# EAGLE board Stepoko (EAGLE 6.5.0)
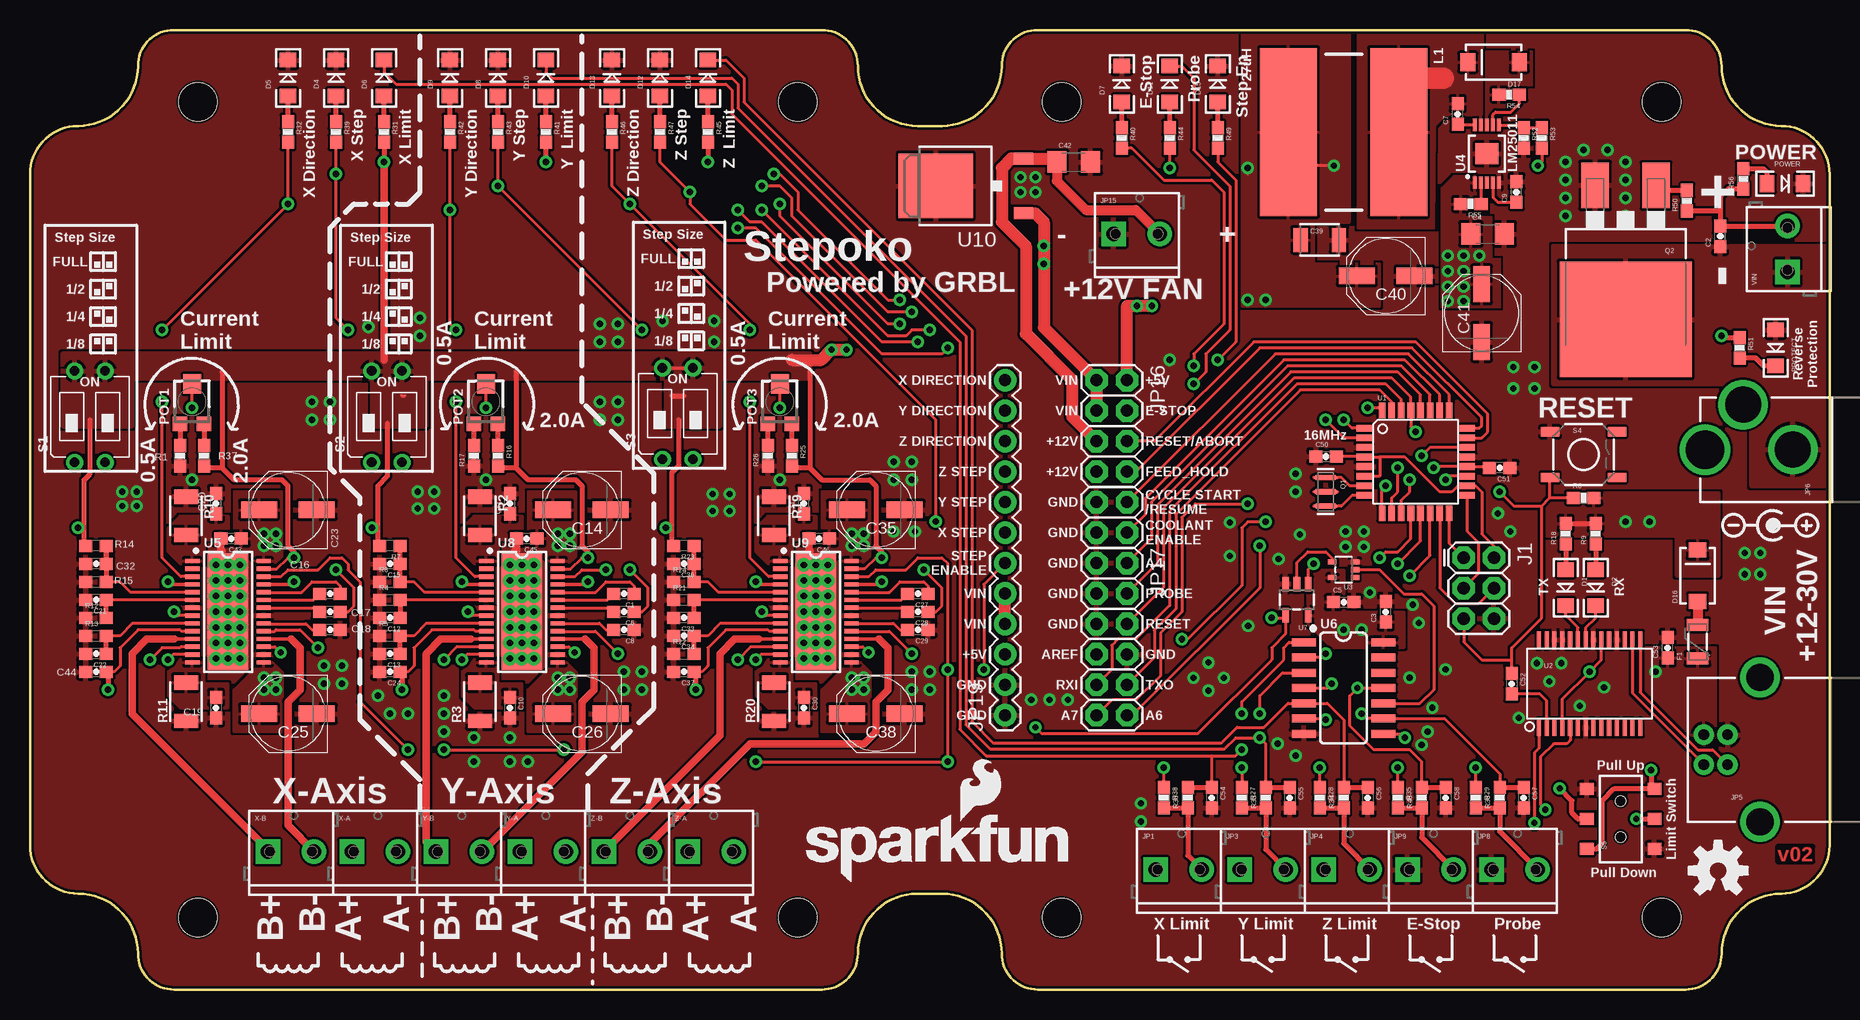
[diagram p2: board, top side]
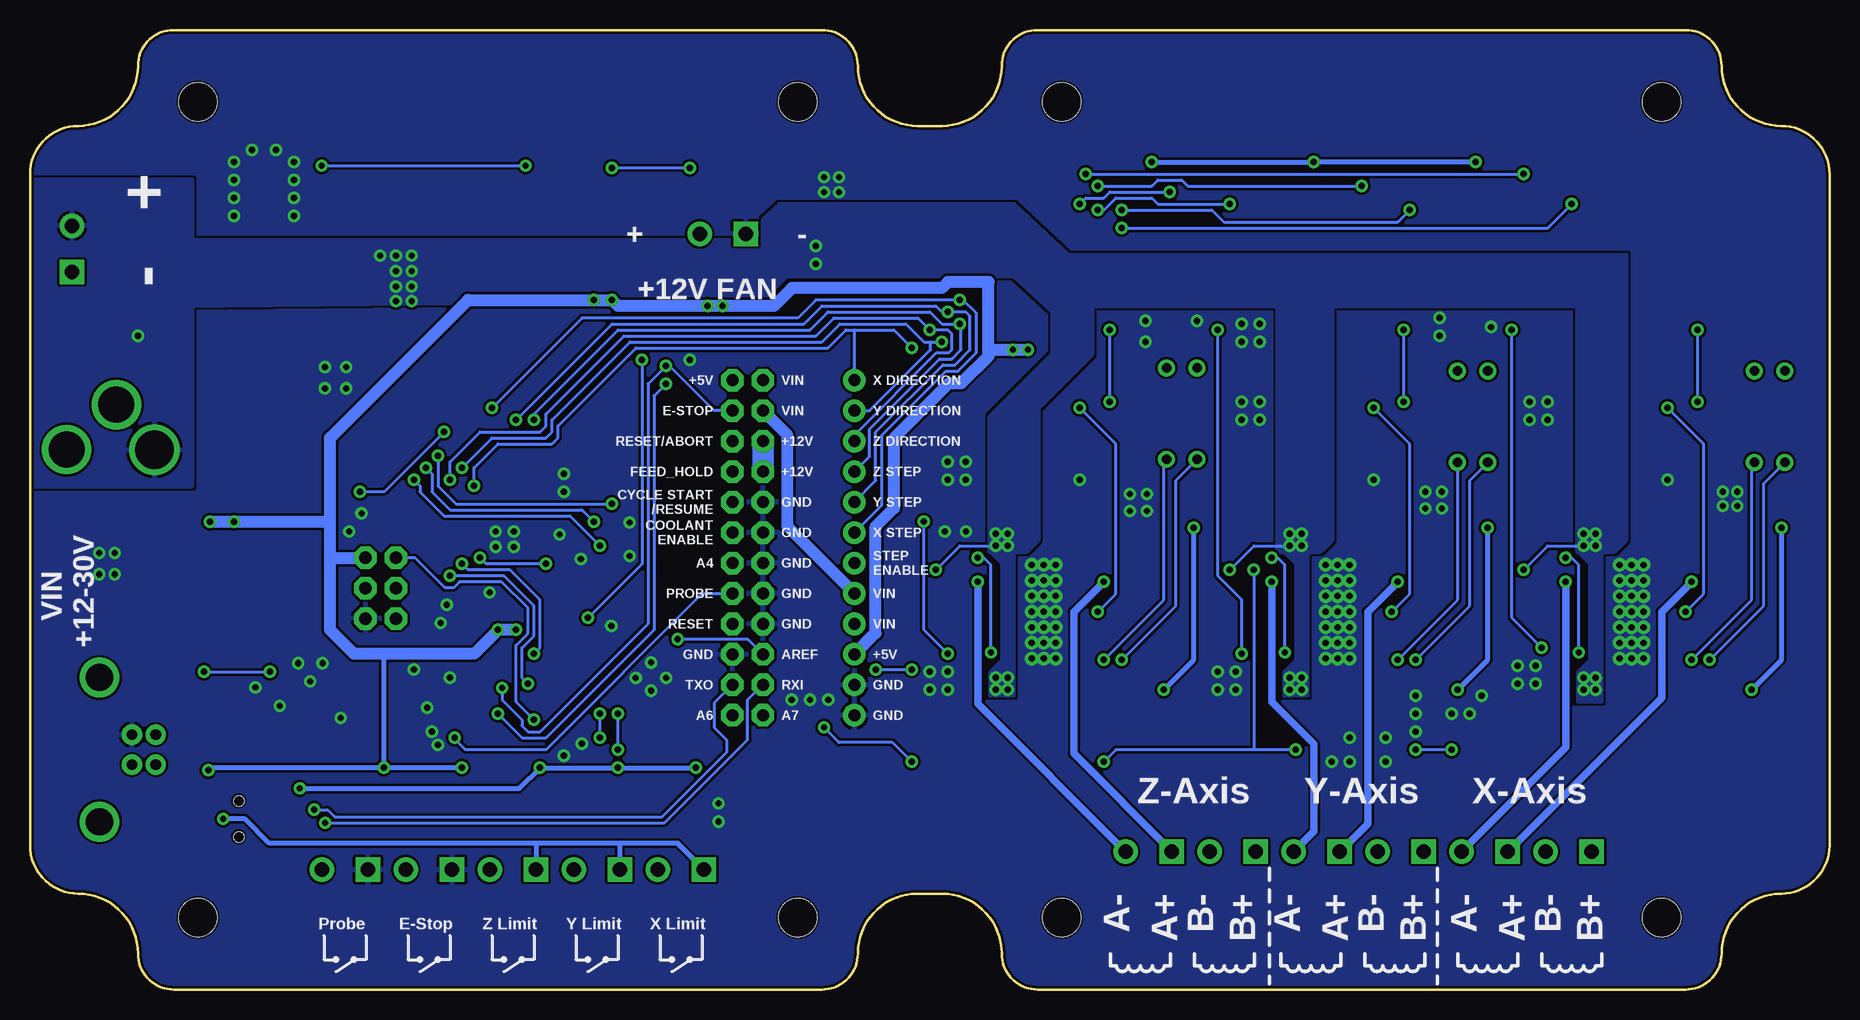
[diagram p3: board, bottom side, seen from below]

Size 150 x 80 mm. Coordinates in mm from the lower left corner, seen from the top.
Copper layers (1*16): Top 0.035mm / dielectric 1.5mm / Bottom 0.035mm
Design rules "SparkFun-2-layer": minimum track width 7mil, minimum drill 15mil, track to track 8mil, track to pad 8mil, pad to pad 8mil, via to via 8mil, smd to smd 8mil, copper to edge 8mil, drill to drill 8mil, minimum pad ring 12mil, minimum via ring 10mil, stop-mask expansion 4mil, vias tented up to drill 20mil, thermal gap 10mil

## Footprints (pad centres in the part's own frame; a part is rotated, then mirrored left to right if it is on the bottom)
0603-CAP = smd 1.1 x 1: 1 -0.85,0; 2 0.85,0
1206 = smd 1.6 x 1.8: 1 -1.4,0; 2 1.4,0
PANASONIC_D = smd 3 x 1.4: + 2.4,0; - -2.4,0
1210 = smd 1.2 x 2: 1 -1.6,0; 2 1.6,0
LED-1206 = smd 1.2 x 1.4: A -1.5,0; C 1.5,0
SMA-DIODE = smd 1.27 x 1.47: A -2.15,0; C 2.15,0
PTC-1206 = smd 1 x 1.8: 1 -1.4,0; 2 1.4,0
2X3 = drill 1.016 pad 1.88 octagon: 1 0,0; 2 0,2.54; 3 2.54,0; 4 2.54,2.54; 5 5.08,0; 6 5.08,2.54
SCREWTERMINAL-3.5MM-2_LOCK = drill 1.2 pad 2.032 square: 1 -0.178,0 | drill 1.2 pad 2.032: 2 3.678,0
USB-B-PTH = drill 0.914 pad 1.676: D+ 0,1.25; D- 1.981,1.25; GND 0,-1.25; VBUS 1.981,-1.25 | drill 2.286: S1 -2.718,-6.02; S2 -2.718,6.02
POWER_JACK_PTH_LOCK = drill 2.997 pad 4.115: GND 0.025,6.557; GNDBREAK 3.762,10.7 | drill 3.2 pad 4.115: PWR 0,13.878
2X6 = drill 1.016 pad 1.88 octagon: 1 0,0; 2 0,2.54; 3 2.54,0; 4 2.54,2.54; 5 5.08,0; 6 5.08,2.54; 7 7.62,0; 8 7.62,2.54; 9 10.16,0; 10 10.16,2.54; 11 12.7,0; 12 12.7,2.54
1X12 = drill 1.016 pad 1.88: 1 0,0; 2 2.54,0; 3 5.08,0; 4 7.62,0; 5 10.16,0; 6 12.7,0; 7 15.24,0; 8 17.78,0; 9 20.32,0; 10 22.86,0; 11 25.4,0; 12 27.94,0
INDUCTOR_SDR1307 = smd 14 x 4.75: P$1 0,4.6; P$2 0,-4.6
TC33X = smd 1.2 x 1.2: 1 -1,-1.825; 3 1,-1.825 | smd 1.5 x 1.6: 2 0,1.5
RESONATOR-SMD = smd 0.45 x 1.905: 1 -1.2,0; 2 0,0; 3 1.2,0
TO-263/D2PAK = smd 2.32 x 3.81: 1 -2.54,-7.045; 3 2.54,-7.045 | smd 11 x 9.65: 2 0,4.125
0603-RES = smd 1.1 x 1: 1 -0.85,0; 2 0.85,0
0603 = smd 1.1 x 1: 1 -0.85,0; 2 0.85,0
209-2LPST = drill 0.8: 1 -1.27,-3.81; 2 1.27,-3.81; 3 1.27,3.81; 4 -1.27,3.81
TACTILE-SWITCH-SMD = smd 1.524 x 0.762: 1 -2.794,1.905; 2 2.794,1.905; 3 -2.794,-1.905; 4 2.794,-1.905
AYZ0202 = smd 1 x 1.15: 1 -2.5,2.825; 2 0,2.825; 3 2.5,2.825; 4 -2.5,-2.825; 5 0,-2.825; 6 2.5,-2.825 | hole 0.85: 1.5,0; -1.5,0
TQFP32-08 = smd 1.27 x 0.559: 1 -4.293,2.8; 2 -4.293,2; 3 -4.293,1.2; 4 -4.293,0.4; 5 -4.293,-0.4; 6 -4.293,-1.2; 7 -4.293,-2; 8 -4.293,-2.8; 17 4.293,-2.8; 18 4.293,-2; 19 4.293,-1.2; 20 4.293,-0.4; 21 4.293,0.4; 22 4.293,1.2; 23 4.293,2; 24 4.293,2.8 | smd 0.559 x 1.27: 9 -2.8,-4.293; 10 -2,-4.293; 11 -1.2,-4.293; 12 -0.4,-4.293; 13 0.4,-4.293; 14 1.2,-4.293; 15 2,-4.293; 16 2.8,-4.293; 25 2.8,4.293; 26 2,4.293; 27 1.2,4.293; 28 0.4,4.293; 29 -0.4,4.293; 30 -1.2,4.293; 31 -2,4.293; 32 -2.8,4.293
SSOP28DB = smd 0.348 x 1.397: 1 -4.225,-3.656; 2 -3.575,-3.656; 3 -2.925,-3.656; 4 -2.275,-3.656; 5 -1.625,-3.656; 6 -0.975,-3.656; 7 -0.325,-3.656; 8 0.325,-3.656; 9 0.975,-3.656; 10 1.625,-3.656; 11 2.275,-3.656; 12 2.925,-3.656; 13 3.575,-3.656; 14 4.225,-3.656; 15 4.225,3.656; 16 3.575,3.656; 17 2.925,3.656; 18 2.275,3.656; 19 1.625,3.656; 20 0.975,3.656; 21 0.325,3.656; 22 -0.325,3.656; 23 -0.975,3.656; 24 -1.625,3.656; 25 -2.275,3.656; 26 -2.925,3.656; 27 -3.575,3.656; 28 -4.225,3.656
SOT353 = smd 0.42 x 0.7: 1 -0.65,-0.95; 2 0,-0.95; 3 0.65,-0.95; 4 0.65,0.95; 5 -0.65,0.95
HVSS0P-10 = smd 0.3 x 1.02: 1 -1,-2.4; 2 -0.5,-2.4; 3 0,-2.4; 4 0.5,-2.4; 5 1,-2.4; 6 1,2.4; 7 0.5,2.4; 8 0,2.4; 9 -0.5,2.4; 10 -1,2.4 | smd 1.905 x 1.727: PAD 0,0
HTSSOP28 = smd 0.36 x 1.19: 1 -4.225,-2.97; 2 -3.575,-2.97; 3 -2.925,-2.97; 4 -2.275,-2.97; 5 -1.625,-2.97; 6 -0.975,-2.97; 7 -0.325,-2.97; 8 0.325,-2.97; 9 0.975,-2.97; 10 1.625,-2.97; 11 2.275,-2.97; 12 2.925,-2.97; 13 3.575,-2.97; 14 4.225,-2.97; 15 4.225,2.97; 16 3.575,2.97; 17 2.925,2.97; 18 2.275,2.97; 19 1.625,2.97; 20 0.975,2.97; 21 0.325,2.97; 22 -0.325,2.97; 23 -0.975,2.97; 24 -1.625,2.97; 25 -2.275,2.97; 26 -2.925,2.97; 27 -3.575,2.97; 28 -4.225,2.97 | drill 0.508: GND@10 -3.9,1; GND@11 -3.9,0; GND@12 -3.9,-1; GND@13 -2.6,-1; GND@14 -2.6,0; GND@15 -2.6,1; GND@16 -1.3,1; GND@17 -1.3,0; GND@18 -1.3,-1; GND@19 0,-1; GND@20 0,0; GND@21 0,1; GND@22 1.3,1; GND@23 1.3,0; GND@24 1.3,-1; GND@25 2.6,-1; GND@26 2.6,0; GND@27 2.6,1; GND@28 3.9,1; GND@29 3.9,0; GND@30 3.9,-1 | smd 9.7 x 3.4: GND@PAD 0,0
SOIC-14 = smd 0.66 x 2.032: 1 -4.445,-3.315; 2 -3.175,-3.315; 3 -1.905,-3.315; 4 -0.635,-3.315; 5 0.635,-3.315; 6 1.905,-3.315; 7 3.175,-3.315; 8 3.175,3.315; 9 1.905,3.315; 10 0.635,3.315; 11 -0.635,3.315; 12 -1.905,3.315; 13 -3.175,3.315; 14 -4.445,3.315
SOT23-5 = smd 0.55 x 1.2: 1 -0.95,-1.3; 2 0,-1.3; 3 0.95,-1.3; 4 0.95,1.3; 5 -0.95,1.3
TO-252 = smd 1 x 1.6: 1 -2.28,-4.8; 2 2.28,-4.8 | smd 5.4 x 6.2: 3 0,2.5
FLANGED_RED_ENCLOSURE-DIMENSION-NO-INNER-HOLES = hole 3.175: 64,6; 86,6; 136,6; 14,6; 64,74; 86,74; 136,74; 14,74

## Placement (x,y rotation side)
C1  0.22uF  [0603-CAP]  49.5,33 180 top
C2  0.1uF  [0603-CAP]  140.89,62.8 90 top
C3  0.1uF  [0603-CAP]  113,31.5 90 top
C4  1.0uF  [1206]  121.5,63 0 top
C5  0.1uF  [0603-CAP]  109.5,32.3 0 top
C6  0.22uF  [0603-CAP]  49.5,31.5 180 top
C7  0.1uF  [0603-CAP]  119,73 90 top
C8  0.22uF  [0603-CAP]  49.5,30 180 top
C9  10nF  [0603-CAP]  123.9,66.5 90 top
C10  0.1uF  [0603-CAP]  40,23.5 270 top
C11  0.1uF  [0603-CAP]  40,40.52 90 top
C12  1000pF  [0603-CAP]  30,31 180 top
C13  1000pF  [0603-CAP]  30,28 180 top
C14  47uF  [PANASONIC_D]  46,40 180 top
C15  0.18uF  [0603-CAP]  30,35.5 180 top
C16  0.22uF  [0603-CAP]  25,33 180 top
C17  0.22uF  [0603-CAP]  25,31.5 180 top
C18  0.22uF  [0603-CAP]  25,30 180 top
C19  0.1uF  [0603-CAP]  15.5,23.5 270 top
C20  0.1uF  [0603-CAP]  15.5,40.52 90 top
C21  1000pF  [0603-CAP]  5.5,32.5 180 top
C22  1000pF  [0603-CAP]  5.5,28 180 top
C23  47uF  [PANASONIC_D]  21.5,40 180 top
C24  0.1uF  [0603-CAP]  30,26.5 180 top
C25  47uF  [PANASONIC_D]  21.5,23 180 top
C26  47uF  [PANASONIC_D]  46,23 180 top
C27  0.22uF  [0603-CAP]  74,33 180 top
C28  0.22uF  [0603-CAP]  74,31.5 180 top
C29  0.22uF  [0603-CAP]  74,30 180 top
C30  0.1uF  [0603-CAP]  64.5,23.5 270 top
C31  0.1uF  [0603-CAP]  64.5,40.52 90 top
C32  0.18uF  [0603-CAP]  5.5,35.5 180 top
C33  1000pF  [0603-CAP]  54.5,31 180 top
C34  1000pF  [0603-CAP]  54.5,29.5 180 top
C35  47uF  [PANASONIC_D]  70.5,40 180 top
C36  0.18uF  [0603-CAP]  54.5,35.5 180 top
C37  0.1uF  [0603-CAP]  54.5,26.5 180 top
C38  47uF  [PANASONIC_D]  70.5,23 180 top
C39  22uF  [1210]  107.5,62.5 0 top
C40  47uF  [PANASONIC_D]  113,59.5 180 top
C41  47uF  [PANASONIC_D]  121,56.4 90 top
C42  1.0uF  [1206]  87,69 0 top
C43  0.1uF  [0603-CAP]  16.76,37.59 180 top
C44  0.1uF  [0603-CAP]  5.5,26.5 180 top
C45  0.1uF  [0603-CAP]  41.4,37.59 180 top
C46  0.1uF  [0603-CAP]  65.79,37.59 180 top
C50  0.1uF  [0603-CAP]  108.04,44.44 0 top
C51  0.1uF  [0603-CAP]  122.5,43.5 180 top
C52  0.1uF  [0603-CAP]  123.5,25.5 270 top
C53  0.1uF  [0603-CAP]  136.5,28.5 90 top
C54  0.1uF  [0603-CAP]  98.5,16 270 top
C55  0.1uF  [0603-CAP]  105,16 270 top
C56  0.1uF  [0603-CAP]  111.5,16 270 top
C57  0.1uF  [0603-CAP]  124.5,16 270 top
C58  0.1uF  [0603-CAP]  118,16 270 top
D1  RED  [LED-1206]  128,33.5 270 top
D2  GREEN  [LED-1206]  130.5,33.5 270 top
D4  GREEN  [LED-1206]  25.5,76 90 top
D5  RED  [LED-1206]  21.5,76 90 top
D6  YELLOW  [LED-1206]  29.5,76 90 top
D7  RED  [LED-1206]  91,75.5 90 top
D8  GREEN  [LED-1206]  39,76 90 top
D9  RED  [LED-1206]  35,76 90 top
D10  YELLOW  [LED-1206]  43,76 90 top
D11  BLUE  [LED-1206]  95,75.5 90 top
D12  GREEN  [LED-1206]  52.5,76 90 top
D13  RED  [LED-1206]  48.5,76 90 top
D14  YELLOW  [LED-1206]  56.5,76 90 top
D15  GREEN  [LED-1206]  99,75.5 90 top
D16  MBRA140  [SMA-DIODE]  139,34.5 90 top
D17  MBRA140  [SMA-DIODE]  122,77.31 180 top
F1  PTCSMD  [PTC-1206]  139,29 90 top
FRAME1  FRAME-LEDGER  [CREATIVE_COMMONS]  68.5,-9 0 top  (outside the outline)
FRAME2  FRAME-LEDGER  [CREATIVE_COMMONS]  68.5,-9 0 top  (outside the outline)
J1  AVR ISP  [2X3]  119.5,36 270 top
JP1  3.5mm  [SCREWTERMINAL-3.5MM-2_LOCK]  94,10 0 top
JP3  3.5mm  [SCREWTERMINAL-3.5MM-2_LOCK]  101,10 0 top
JP4  3.5mm  [SCREWTERMINAL-3.5MM-2_LOCK]  108,10 0 top
JP5  USB-B  [USB-B-PTH]  141.5,20 180 top
JP6  POWER  [POWER_JACK_PTH_LOCK]  153.5,45 90 top
JP8  3.5mm  [SCREWTERMINAL-3.5MM-2_LOCK]  122,10 0 top
JP9  3.5mm  [SCREWTERMINAL-3.5MM-2_LOCK]  115,10 0 top
JP15  3.5mm  [SCREWTERMINAL-3.5MM-2_LOCK]  90.5,63 0 top
JP16  2X6 FEMALE  [2X6]  88.9,50.8 270 top
JP17  2X6 FEMALE  [2X6]  88.9,35.56 270 top
JP19  M12PTH  [1X12]  81.28,22.86 90 top
L1  27uH  [INDUCTOR_SDR1307]  109.5,71.5 270 top
LOGO1  OSHW-LOGOM  [OSHW-LOGO-M]  140.72,9.91 0 top
LOGO2  SFE_LOGO_NAME_FLAME.2_INCH  [SFE_LOGO_NAME_FLAME_.2]  64.01,8.89 0 top
POT1  2K_LINEAR_POT_SMD  [TC33X]  13.5,49 0 top
POT2  2K_LINEAR_POT_SMD  [TC33X]  38,49 0 top
POT3  2K_LINEAR_POT_SMD  [TC33X]  62.5,49 0 top
POWER  BLUE  [LED-1206]  146.3,67.2 0 top
PROTECT  RED  [LED-1206]  145.5,53.5 270 top
Q1  16MHZ  [RESONATOR-SMD]  108,41.5 270 top
Q2  100A/100V  [TO-263/D2PAK]  133,60 180 top
R1  240  [0603-RES]  12.5,44.5 90 top
R2  0.1  [1210]  37.5,39.5 270 top
R3  0.1  [1210]  37.5,24 90 top
R4  39K  [0603]  30,32.5 0 top
R5  39K  [0603]  30,29.5 0 top
R6  10K  [0603-RES]  129.5,41 0 top
R7  5.6K  [0603]  30,37 180 top
R8  5.6K  [0603]  30,34 0 top
R9  1K  [0603-RES]  130.5,38 90 top
R10  0.1  [1210]  13,39.5 270 top
R11  0.1  [1210]  13,24 90 top
R12  39K  [0603]  5.5,31 0 top
R13  39K  [0603]  5.5,29.5 0 top
R14  5.6K  [0603]  5.5,37 180 top
R15  5.6K  [0603]  5.5,34 0 top
R16  1K  [0603-RES]  39,44.5 270 top
R17  240  [0603-RES]  37,44.5 90 top
R18  1K  [0603-RES]  128,38 90 top
R19  0.1  [1210]  62,39.5 270 top
R20  0.1  [1210]  62,24 90 top
R21  39K  [0603]  54.5,32.5 0 top
R22  39K  [0603]  54.5,28 0 top
R23  5.6K  [0603]  54.5,37 180 top
R24  5.6K  [0603]  54.5,34 0 top
R25  1K  [0603-RES]  63.5,44.5 270 top
R26  240  [0603-RES]  61.5,44.5 90 top
R27  10K  [0603-RES]  101,16 270 top
R28  10K  [0603-RES]  107.5,16 270 top
R29  10K  [0603-RES]  120.5,16 270 top
R30  1K  [0603-RES]  96.5,16 90 top
R31  1K  [0603-RES]  29.5,71.5 270 top
R32  1K  [0603-RES]  21.5,71.5 270 top
R33  1K  [0603-RES]  103,16 90 top
R34  1K  [0603-RES]  109.5,16 90 top
R35  10K  [0603-RES]  114,16 270 top
R36  1K  [0603-RES]  122.5,16 90 top
R37  1K  [0603-RES]  14.5,44.5 270 top
R38  10K  [0603-RES]  94.5,16 270 top
R39  1K  [0603-RES]  25.5,71.5 270 top
R40  1K  [0603-RES]  91,71 270 top
R41  1K  [0603-RES]  43,71.5 270 top
R42  1K  [0603-RES]  35,71.5 270 top
R43  1K  [0603-RES]  39,71.5 270 top
R44  1K  [0603-RES]  95,71 270 top
R45  1K  [0603-RES]  56.5,71.5 270 top
R46  1K  [0603-RES]  48.5,71.5 270 top
R47  1K  [0603-RES]  52.5,71.5 270 top
R48  1K  [0603-RES]  116,16 90 top
R49  1K  [0603-RES]  99,71 270 top
R50  1K  [0603-RES]  138.12,65.77 90 top
R51  10K  [0603-RES]  142.5,53.5 270 top
R52  10K  [0603-RES]  124.5,71 270 top
R53  9.76K  [0603-RES]  126,71 270 top
R54  50.0m  [0603-RES]  123.3,74.61 180 top
R55  348K  [0603-RES]  120.1,65.5 180 top
R56  10K  [0603-RES]  142.8,67.6 90 top
S1  2-POS-DIPCTS-THRU-HOLE  [209-2LPST]  4.99,47.76 0 top
S2  2-POS-DIPCTS-THRU-HOLE  [209-2LPST]  29.75,47.76 0 top
S3  2-POS-DIPCTS-THRU-HOLE  [209-2LPST]  53.99,48.02 0 top
S4  Reset  [TACTILE-SWITCH-SMD]  129.5,44.6 0 top
S5  DPDT  [AYZ0202]  132.59,14.22 90 top
U1  ATMEGA328  [TQFP32-08]  115.5,44 0 top
U2  CY7C65213  [SSOP28DB]  130,25.5 0 top
U3  74LVC1G04  [SOT353]  109.5,35 90 top
U4  LM25011  [HVSS0P-10]  121.44,69.68 0 top
U5  DRV8811  [HTSSOP28]  16.5,31.5 270 top
U6  74HC7014D  [SOIC-14]  109.5,24.5 270 top
U7  74AHC1G08  [SOT23-5]  105.6,32.5 180 top
U8  DRV8811  [HTSSOP28]  41,31.5 270 top
U9  DRV8811  [HTSSOP28]  65.5,31.5 270 top
U10  [TO-252]  78,67 90 top
U$1  [FLANGED_RED_ENCLOSURE-DIMENSION-NO-INNER-HOLES]  0,0 0 top
VIN  3.5mm  [SCREWTERMINAL-3.5MM-2_LOCK]  146.5,60 90 top
X-A  3.5mm  [SCREWTERMINAL-3.5MM-2_LOCK]  27,11.5 0 top
X-B  3.5mm  [SCREWTERMINAL-3.5MM-2_LOCK]  20,11.5 0 top
Y-A  3.5mm  [SCREWTERMINAL-3.5MM-2_LOCK]  41,11.5 0 top
Y-B  3.5mm  [SCREWTERMINAL-3.5MM-2_LOCK]  34,11.5 0 top
Z-A  3.5mm  [SCREWTERMINAL-3.5MM-2_LOCK]  55,11.5 0 top
Z-B  3.5mm  [SCREWTERMINAL-3.5MM-2_LOCK]  48,11.5 0 top

## Tracks (layer width: path | path; a pad name or v marks a point on that pad's centre or on a via)
5V  (via drill 0.51, 0.51 pad 0.25)
  Top 0.254: U5.10 12.62,29.88 12.5,30 9,30 7.5,28.5 7.5,27 7,26.5 C44.1 | U5.27 20.57,35.08 21.5,36 v22,36 | U5.17 20.43,28.57 v20.9,28.1 | 55,26.5 C37.1 55.5,26.5 56,26.5 56.5,27 56.5,28.5 58,30 61.5,30 61.62,29.88 U9.10 | U8.17 44.92,28.57 v45.4,28.1 | v46.5,36 46,36 45.08,35.08 U8.27 | U9.17 69.42,28.57 v69.9,28.1 | v71,36 70.5,36 69.58,35.08 U9.27 | 30.96,49.54 31,49.5 31.23,49.5 | S3.4 S3.3 | U8.10 37.12,29.88 37,30 33.5,30 32,28.5 32,27 31.5,26.5 C24.1 | R53.2 126,69 v125.7,68.7 | v108.7,68.7 104.9,68.7 L1.P$2 | v95,68.5 R44.2 | 112.5,44.4 U1.4 111.17,44.44 C50.2 | 112.5,44.4 112.5,42.8 U1.6 | v101.5,68.5 101.5,68 | 112.5,44.4 114.6,44.4 117.5,41.5 118.5,41.5 119,42 U1.18 120.5,42 121,41.5 121,38 122,37 122,36 J1.2 | R25.2 63.5,43.5 | R29.1 v120.5,18.5 | R35.1 v114,18.5
  Top 0.406: R18.2 R9.2 | R31.2 v29.5,69 | v43,69 R41.2 | R45.2 v56.5,69 | 16,51.5 16,43.5 | 16,43.5 14.65,43.5 R37.2 | v22,36 22,36.5 21.5,37 21.5,42 21,42.5 17,42.5 16,43.5 | v46.5,36 46.5,36.5 46,37 46,42 45.5,42.5 41.5,42.5 40.5,43.5 | 40.5,51.5 40.5,43.5 | 40.5,43.5 39,43.5 R16.2 | 65,51.5 65,43.5 | 65,43.5 63.5,43.5 | 65,43.5 66,42.5 70,42.5 70.5,42 70.5,37 71,36.5 v71,36 | R14.2 4.5,37.15 4.5,38.5 | R7.2 29,37.15 29,38.5 | R23.2 53.5,37.15 53.5,38.5 | 53.5,49.5 54.5,49.5 | v53,38.5 53.5,38.5 | v55.5,25 55.5,26.5 | v28.5,38.5 29,38.5 | v4,38.5 4.5,38.5 | C44.1 6.5,26.35 v6.5,25 | C24.1 31,26.35 v31,25 | S5.1 130.6,11.72 131.06,12.19 131.06,15.75 132.08,16.76 135.13,16.76 | 135.13,16.76 135.37,16.76 S5.6 | v135.13,18.29 135.13,16.76 | 53.5,38.5 53.5,43.09 54.1,43.69 54.1,47.5 | 4.5,38.5 4.5,42.5 5,43 5,47.5 | 29,38.5 29,42 29.8,42.8 29.8,47.2
  Top 0.61: v29.5,69 29.5,52.5
  Top 1.016: 63.5,52.5 65.96,52.5 v66.8,53.34 v68.07,53.34 | v93.51,57 91.44,57 JP16.2
  Bottom 0.254: v20.9,28.1 20.9,35.4 21.5,36 v22,36 | v45.4,28.1 45.4,35.4 46,36 v46.5,36 | v69.9,28.1 69.9,35.4 70.5,36 v71,36 | v125.7,68.7 v108.7,68.7 | v95,68.5 v101.5,68.5
  Bottom 0.406: v29.5,69 v43,69 v56.5,69 | v55.5,25 53,27.5 v53,38.5 | v31,25 28.5,27.5 v28.5,38.5 | v6.5,25 4,27.5 v4,38.5 | v120.49,18.5 120.49,28 | v114,18.5 v120.49,18.5 | v120.49,18.5 v120.5,18.5 134.92,18.5 v135.13,18.29
  Bottom 1.016: v109.5,30 v111,30 113,28 120.49,28 123,28 125,30 125,36 | 125,36 J1.2 | 125,36 125,39 | 125,39 v133,39 v135,39 | 125,39 125,46 113.5,57.5 v103,57.5 v101.5,57.5 101,57 v93.51,57 v92.26,57 88,57 86.5,58.5 74,58.5 73.5,59 70.1,59 70.1,53.22 | JP19.3 79.5,29.72 79.5,38.61 77.98,40.13 77.98,45.97 73.41,50.55 72.39,50.55 70.1,52.83 70.1,53.22 | 70.1,53.22 69.99,53.34 v66.8,53.34
  pour Top: 2.73,47 8.5,47 8.5,51 28.5,51 28.5,47 33,47 33,51 53,51 53,47 57.5,47 57.5,51 65,51 65,53 2.73,53
  pour Top: 106.5,35 109.5,35 109.5,31.5 114.5,31.5 114.5,28.5 108.5,28.5 106.5,30.5
  pour Top: 129.5,41.4 129.5,40.6 126.4,40.6 126.4,37.8 137.2,37.8 137.2,34.5 140.8,34.5 140.8,41.4
  pour Top: 101,57 112.5,57 112.5,60.5 107,60.5 107,64 110,64 110,80 101,80
A0-RESET/ABORT
  Top 0.254: U1.23 121,46 121.5,46.5 121.5,48 115.5,54 102,54 93.72,45.72 JP16.6
A1-FEED_HOLD
  Top 0.254: U1.24 120.8,46.8 121,47 121,47.7 115.2,53.5 102.5,53.5 92.18,43.18 JP16.8
A2-CYCLE_START/RESUME
  Top 0.254: U1.25 118.3,49.6 114.9,53 103.8,53 JP16.10
A3-COOLANT_ENABLE
  Top 0.254: U1.26 117.5,49.6 114.6,52.5 104.52,52.5 92.96,40.95 92.96,39.62 JP16.12
A4
  Top 0.254: U1.27 116.7,49.6 114.3,52 104.83,52 93.47,40.64 93.47,37.59 JP17.2
A5-PROBE  (via drill 0.51)
  Top 0.254: U6.8 114.28,21.32 v114.6,21 | U1.28 115.9,49.6 114,51.5 105.09,51.5 93.98,40.39 93.98,35.56 JP17.4
  Bottom 0.254: v114.6,21 114.6,20.9 113.7,20 107,20 93.98,33.02 JP17.4
A6  (via drill 0.51)
  Top 0.254: U1.19 118.3,42.8 v118,42.5 | v102.5,37 102.5,33.5 91.86,22.86 JP17.12
  Bottom 0.254: v118,42.5 117.5,42 117.5,41.5 115.5,39.5 105,39.5 v102.5,37
A7  (via drill 0.51)
  Top 0.254: U1.22 116.7,45.2 v116,44.5 | v101.5,40.5 97.14,40.5 96.01,39.37 96.01,31.5 94.23,29.72 94.23,26.16 92.2,24.13 90.17,24.13 JP17.11
  Bottom 0.254: v116,44.5 116,42 114.5,40.5 v101.5,40.5
AREF  (via drill 0.51)
  Top 0.254: 121.5,43.6 U1.20 117.1,43.6 v117,43.5 | 121.5,43.6 121.6,43.6 121.7,43.5 | C51.2 121.5,43.5 121.5,43.6 | v103,39 101.5,39 101,38.5 101,33.69 96.52,29.21 v96.01,29.21
  Bottom 0.254: v117,43.5 116.5,43 116.5,41.5 115,40 104,40 v103,39 | v96.01,29.21 90.17,29.21 JP17.7
D2-STEP-X  (via drill 0.51, 0.51 pad 0.25)
  Top 0.254: U5.19 20.38,29.88 20.5,30 22.5,30 v24,28.5 | v26.5,55 25.5,56 v25.5,68 R39.2 | v62,68 62.5,68 64,66.5 64,65 71.5,57.5 v72.5,57.5 | U1.32 112.49,48.5 v111.5,48.5
  Bottom 0.254: v24,28.5 26.5,31 v26.5,55 | v111.5,48.5 104,56 86,56 84.5,57.5 72.64,57.5 v72.5,57.5 72.23,57.5 71.12,56.39 71.12,53.09 72.64,51.56 73.66,51.56 78.99,46.23 78.99,40.39 JP19.7 | v62,68 v25.5,68
D3-STEP-Y  (via drill 0.51, 0.51 pad 0.25)
  Top 0.254: U8.19 47.12,29.88 v49,28 | v51,55 v39,67 R43.2 | U1.1 110.2,46.8 v109.5,47.5 | v73.5,56.5 71.5,56.5 63.5,64.5 63.5,66 62.5,67 v61,67
  Bottom 0.254: v49,28 49,32.5 51,34.5 v51,55 | v109.5,47.5 101.5,55.5 85.5,55.5 84,57 74.5,57 74,56.5 73.66,56.5 v73.5,56.5 71.99,56.5 71.63,56.13 71.63,53.34 72.9,52.07 73.91,52.07 79.5,46.48 79.5,42.42 JP19.8 | v61,67 56.5,67 56,67.5 54,67.5 53.5,67 v39,67
D4-STEP-Z  (via drill 0.51, 0.51 pad 0.25)
  Top 0.254: U9.19 71.62,29.88 v73.5,28 | v75.5,39.02 75.5,47.5 60.5,62.5 58,62.5 55,65.5 v55,66.5 52.5,69 R47.2 | U1.2 109.5,46 v108,47.5 | v72.5,55.5 71.5,55.5 62.5,64.5 v62.5,65.5
  Bottom 0.254: v73.5,28 75.5,30 v75.5,39.02 | v62.5,65.5 62,66 60.5,66 60,66.5 v55,66.5 | v108,47.5 108,48 101,55 85,55 83.5,56.5 75,56.5 74,55.5 v72.5,55.5 72.39,55.5 72.39,53.34 73.15,52.58 74.17,52.58 80.01,46.74 80.01,44.45 JP19.9
D5-DIR-X  (via drill 0.51, 0.51 pad 0.25)
  Top 0.254: U5.3 12.57,34.42 11,36 v11,49 | v11,55 v21.5,65.5 R32.2 | U1.9 112.7,41.7 v113,42 | v76.5,53.5 76,53 71,53 60.5,63.5 v59,63.5
  Bottom 0.254: v11,49 v11,55 | v113,42 113,43.5 111,45.5 106.5,45.5 106,46 106,47 99.5,53.5 83.5,53.5 82,55 81.28,55 | 81.28,55 78,55 v76.5,53.5 | v59,63.5 23.5,63.5 v21.5,65.5 | JP19.12 81.28,55
D6-DIR-Y  (via drill 0.51, 0.51 pad 0.25)
  Top 0.254: U8.3 37.08,34.42 35.5,36 v35.5,49 | v35.5,55 35,55.5 v35,65 R42.2 | U1.10 113.5,41 114,41.5 v114,43.5 | v74,54 71,54 61,64 60,64 v59,65
  Bottom 0.254: v35.5,49 v35.5,55 | v114,43.5 111.5,46 107,46 106.5,46.5 106.5,47.5 100,54 84,54 82.5,55.5 77,55.5 75.5,54 74.93,54 | 74.93,54 v74,54 | v59,65 51.5,65 50.5,64 36,64 v35,65 | JP19.11 80.01,48.26 74.93,53.34 74.93,54
D7-DIR-Z  (via drill 0.51, 0.51 pad 0.25)
  Top 0.254: U9.3 61.58,34.42 60,36 v60,49 | v60,55 60,55.5 v50,65.5 48.5,67 R46.2 | U1.11 114.3,40.8 115,41.5 v115,42.5 | v75,55 73.5,55 73,54.5 71.5,54.5 v61,65
  Bottom 0.254: v60,49 v60,55 | v115,42.5 115,44 112.5,46.5 107.5,46.5 107,47 107,48 100.5,54.5 84.5,54.5 83,56 76,56 v75,55 73.5,55 73.15,54.65 73.15,53.34 73.41,53.09 74.42,53.09 81.28,46.23 JP19.10 | v61,65 60.5,65 59.5,66 56.5,66 56,65.5 v50,65.5
D8-STEP_EN  (via drill 0.51, 0.51 pad 0.25)
  Top 0.254: U7.1 106.55,35.05 v107,35.5 | U1.12 115.1,37.6 114,36.5 113,36.5 v112.5,36
  Bottom 0.254: v107,35.5 112,35.5 v112.5,36
D9-LIM-X  (via drill 0.51)
  Top 0.254: v114,35.5 115.9,37.4 U1.13 | v108,28 107.67,27.68 U6.2
  Bottom 0.254: v108,28 107.5,28.5 107.5,32.5 110,35 113.5,35 v114,35.5
D10-LIM-Y  (via drill 0.51, 0.51 pad 0.25)
  Top 0.254: U6.4 108.14,25.14 v108.5,25.5 | v115,34.5 116.7,36.2 U1.14
  Bottom 0.254: v108.5,25.5 109,26 109,28.5 108,29.5 108,32 110.5,34.5 v115,34.5
D+
  Top 0.254: U2.15 134.22,24.77 139,20 140.25,20 JP5.D+
D-
  Top 0.254: JP5.D- 139.52,18.78 133.57,24.73 U2.16
DTR
  Top 0.254: U2.2 126.42,24.07 125.85,24.65 C52.2
ESTOP  (via drill 0.51)
  Top 0.254: R48.2 116,19 115,20 112,20 110,22 110,24.5 v110.64,25.14 U6.11 | v97,52 97,53 99.5,55.5 99.5,66.5 98.5,67.5 94.5,67.5 91.85,70.15 R40.2
  Top 0.406: R48.2 C58.1
  Bottom 0.254: v110.64,25.14 110.64,24.14 109,22.5 109,22 108.5,21.5 107.5,21.5 98.5,30.5 98.5,50.5 v97,52 96.7,52 92.96,48.26 JP16.4
GND  (via drill 0.51, 0.51 pad 0.25)
  Top 0.61: C45.2 40.55,36.58 40.39,36.58 | C46.2 64.94,36.58 65.02,36.58 | C43.2 15.91,36.58 16,36.58
  other vias: 128,64.5 128,66 128,67.5 128,69 129.5,70 131.5,70 133,69 133,67.5 133,66 133,64.5 38,42.5 62.5,42.5 111.7,33.1 116,20.4 116.5,21.5 116.9,23.5 118,26.7 115,26 105.5,19.5 104,20.5 13.5,42.5 26,27 26,25.5 24.5,25.5 24.5,27 49.5,26.5 51,26.5 51,25 49.5,25 73.5,25 73.5,26.5 75,26.5 75,25 72,42.5 73.5,42.5 73.5,44 72,44 29,24.5 30,23 31.5,23 40,21 37,21 34.5,24.5 34.5,23 34.5,21.5 37,19 40,19 41.5,19 105.5,43 105.5,41.5 95,52.5 28.21,55.25 32.5,54.5 32.5,56 47.5,55.5 49,55.5 49,54 47.5,54 52.72,55.75 57.02,55.75 57.02,54 23.5,49 23.5,47.5 25,47.5 25,49 47.5,49 47.5,47.5 49,47.5 49,49 111.19,36.91 109.67,36.91 109.67,38.18 111.19,38.18 105.86,37.93 104.08,35.89 101.54,30.31 100.02,36.15 100.02,38.94 98.24,27.26 99.51,25.99 98.24,24.92 96.97,25.99 142.94,36.4 144.22,36.4 144.22,34.62 142.94,34.62 123.64,51.9 125.42,51.9 125.42,50.12 123.64,50.12 82.55,67.74 83.82,67.74 83.82,66.47 82.55,66.47 71.98,38.18 73.75,38.18 122.37,39.7 123.38,38.18 115.76,30.56 115.26,32.08 125.62,27.21 127.65,27.21 126.64,25.68 124.1,22.64 129.18,23.65 131.21,25.18 92.6,14 92.6,15.52 86.5,24.16 84.98,24.16 83.46,24.16 7.7,41.5 8.9,41.5 8.9,40.3 7.7,40.3 32.3,41.5 32.3,40.1 33.7,40.1 33.7,41.5 56.9,41.3 58.3,41.3 58.3,39.9 56.9,39.9
  pour Top (rank 6): 0,0 149.86,0 149.86,81.28 0,81.28
  pour Bottom (rank 6): 0,0 149.86,0 149.86,81.28 0,81.28
  pour Top: 123,68.2 123,66.3 122.2,66.3 122.2,68.2
MISO-D12-LIMIT-Z  (via drill 0.51 pad 0.25)
  Top 0.254: U6.6 107.91,22.59 v108,22.5 | J1.1 118.3,37.2 U1.16
  Bottom 0.254: v108,22.5 109.5,24 109.5,28.7 108.5,29.7 108.5,31.8 110.7,34 114.2,34 114.7,33.5 115.4,33.5 117.9,36 J1.1
MOSI-D11-SPINDLE_PWM
  Top 0.254: U1.15 117.5,33.5 118.81,32.19 120.77,32.19 J1.4
N$1
  Top 0.254: U4.7 121.94,72.92 122.17,73.15 123.44,73.15 124.15,73.86 R54.1
N$2
  Top 0.406: R9.1 D2.A
N$3
  Top 0.406: R18.1 D1.A
N$4  (via drill 0.51)
  Top 0.406: v133.9,14.22 S5.5
  Bottom 0.406: JP1.1 96.01,12.19 100.82,12.19 | 100.82,12.19 107.82,12.19 | 107.82,12.19 JP4.1 | JP3.1 100.82,12.19 | 107.82,12.19 130.05,12.19 132.08,14.22 v133.9,14.22
N$5
  Top 0.406: R40.1 D7.A
N$6
  Top 0.254: U1.8 110.2,41.2 109.3,40.3 109.02,40.3
N$7
  Top 0.406: R38.2 R30.1 96.5,11.18 JP1.2
N$8
  Top 0.254: U1.7 110,42 109.3,42.7 109.02,42.7
N$9
  Top 0.406: POT1.3 R37.1
N$10
  Top 0.406: POT1.1 R1.2 12.5,45
N$11
  Top 0.254: U8.6 30.88,32.48 R4.2
  Top 0.406: R4.2 C12.1
N$12
  Top 0.254: U8.9 33.02,30.52 32,29.5 31,29.5 R5.2
  Top 0.406: C13.1 30.85,29.35 31,29.5
N$13
  Top 0.406: R44.1 D11.A
N$14
  Top 0.254: U8.5 32.88,33.12 32,34 R8.2
  Top 0.406: R8.2 C15.1 R7.1
N$15  (via drill 0.51)
  Top 0.254: U8.13 36.42,27.93 v36,27.5
  Bottom 0.254: v36,27.5 31,32.5 31,43.94 S2.2
N$16
  Top 0.406: R49.1 D15.A
N$17
  pour Top: 150,42 143.5,42 143.5,50.5 127,50.5 127,62 150,62
N$18
  Top 0.406: R31.1 D6.A
N$19
  Top 0.406: R32.1 D5.A
N$20
  Top 0.406: R39.1 D4.A
N$21
  Top 0.254: U4.6 124.27,72.08 R52.1 R53.1
N$22
  Top 0.406: R41.1 D10.A
N$23  (via drill 0.51)
  Top 0.254: U8.12 35.58,28.57 v34.5,27.5
  Bottom 0.254: v34.5,27.5 30,32 30,42.43 S2.1
N$24
  Top 0.254: U5.24 22.62,33.12 23.5,34 25.5,34 25.85,33.65 C16.1
N$25
  Top 0.254: U5.23 23.62,32.48 C16.2
N$26
  Top 0.254: U8.20 47.48,30.52 48,30 C8.2
N$27  (via drill 0.51)
  Top 0.254: U8.8 36.83,31.18 v36.5,31.5 | v38,48.5 POT2.2
  Bottom 0.254: v36.5,31.5 35,33 35,45.5 v38,48.5
N$28
  Top 0.254: 13.51,32.5 C21.1
  Top 0.305: U5.6 13.51,32.5
  Top 0.406: R12.2 C21.1
N$29
  Top 0.254: U5.9 8.53,30.52 7.5,29.5 R13.2
  Top 0.406: C22.1 R13.2
N$30
  Top 0.254: U5.5 8.38,33.12 7.5,34 R15.2
  Top 0.406: C32.1 R14.1 R15.2
N$31
  Top 0.406: R42.1 D9.A
N$32
  Top 0.254: U2.23 129.03,30.18 128,31.2 128,31.9 | 128,31.9 127.9,32 | 128,31.9 D1.C
N$33
  Top 0.254: U2.22 129.68,30.18 130.5,31 D2.C
N$34  (via drill 0.51)
  Top 0.254: U5.13 11.93,27.93 v11.5,27.5
  Bottom 0.254: v11.5,27.5 6.5,32.5 6.5,43.71 S1.2
N$35  (via drill 0.51)
  Top 0.254: U5.12 12.57,28.57 12.5,28.5 11,28.5 v10,27.5
  Bottom 0.254: v10,27.5 5.5,32 5.5,42.17 S1.1
N$36
  Top 0.406: R43.1 D8.A
N$37
  Top 0.305: U5.11 12,29.23
  Top 0.61: 12,29.23 9.72,29.23 8.5,28 8.5,23 19.82,11.68 X-B.1
N$38
  Top 0.254: U5.20 19.5,30.5 23,30.5 23.5,30 C18.2
N$39
  Top 0.254: Q2.1 135.54,67 135.5,67
  Top 0.406: R50.2 136.16,66.62 135.78,67 135.5,67
N$40
  Top 0.406: R45.1 D14.A
N$41
  Top 0.406: PROTECT.C 144.5,52 143.85,52.65 R51.2
N$42
  Top 0.406: R27.2 R33.1 103,11.68 JP3.2
N$43
  Top 0.406: R34.1 109.5,15 | R28.2 109.35,15.15 109.5,15 | 109.5,15 109.5,12.18 JP4.2
N$44
  Top 0.254: U7.2 105.6,35.6 106.5,36.5 108,36.5 108.5,36 108.5,35.7 U3.4
N$45
  Top 0.406: R16.1 39,47 POT2.3 39,47.5
N$46
  Top 0.406: R17.2 POT2.1
N$47
  Top 0.254: U8.22 48.33,31.82 C6.2
N$48
  Top 0.254: U8.24 47.12,33.12 48,34 | 48,34 50,34 | 50,34 50.35,33.65 C1.1 | 48,34 50,34
N$49
  Top 0.254: U8.23 48.12,32.48 C1.2
N$50
  Top 0.305: U8.11 36.73,29.23
  Top 0.61: 36.73,29.23 34.23,29.23 33,28 33,12.32 Y-B.1
N$51
  Top 0.813: D16.A F1.2
N$52
  Top 0.254: U6.10 115.86,23.86 117,25 117,32 116,33 114.5,33 112.5,35 U3.2
N$53
  Top 0.406: R36.1 122.5,15 | R29.2 122.35,15.15 122.5,15 | 122.5,15 122.5,13.18 JP8.2
N$55
  Top 0.305: U8.18 46.27,29.23
  Top 0.61: 46.27,29.23 47,28.5 47,25 46,24 46,19.82 Y-B.2
N$56  (via drill 0.51)
  Top 0.305: U8.4 36.23,33.77 v36,34
  Bottom 0.61: v36,34 38.5,31.5 38.5,13.82 Y-A.1
N$57
  Top 0.406: R48.1 116,15 | R35.2 115.85,15.15 116,15 | 116,15 116,12.68 JP9.2
N$58  (via drill 0.51)
  Top 0.305: U8.25 46.27,33.77 v46.5,34
  Bottom 0.61: v46.5,34 46.5,24 43,20.5 43,13.18 Y-A.2
N$59
  pour Top: 39,27.5 37,27.5 36,26.5 36,24.5 37,23.5 41,23.5 41,25.5 39,25.5
N$62
  Top 0.406: POWER.A 144.8,68.1 144.5,68.4 142.85,68.4 R56.2
N$63
  Top 0.406: R46.1 D13.A
N$64
  Top 0.406: R47.1 D12.A
N$65
  pour Top: 121.4,71.7 121.7,71.7 121.7,72.7 122.1,73.1 122.6,73.1 122.9,73.4 122.9,74.7 123.6,75.4 125.2,75.4 125.2,78.2 121.4,78.2
N$66
  Top 0.254: U4.2 R55.1 121,65.5
N$67
  Top 0.254: U5.22 23.82,31.82 C17.2
N$68
  Top 0.254: U4.10 119.07,72.08 C7.1
N$69
  Top 0.305: U5.18 21.77,29.23
  Top 0.61: 21.77,29.23 22.5,28.5 22.5,25 21.5,24 21.5,13.68 X-B.2
N$70
  Top 1.778: 115.2,76 117.8,76
  pour Top (rank 2): 110.7,63.5 117,63.5 117.1,72 118,72.9 120.7,72.9 120.7,71.7 121.1,71.7 121.1,80.5 110.7,80.5
N$71  (via drill 0.51)
  Top 0.305: U5.4 11.72,33.77 v11.5,34
  Bottom 0.61: v11.5,34 14,31.5 14,24.32 X-A.1
N$72
  pour Top: 39,35.5 37,35.5 36,36.5 36,38.5 37,39.5 41,39.5 41,37.5 39,37.5
N$73
  Top 0.254: U9.6 55.38,32.48 R21.2
  Top 0.406: C33.1 R21.2
N$74
  Top 0.254: U9.9 57.52,30.52 56.5,29.5 C34.1
  Top 0.406: R22.2 C34.1
N$75
  Top 0.254: U9.5 57.38,33.12 56.5,34 R24.2 55,34
  Top 0.406: R24.2 C36.1 R23.1
N$76  (via drill 0.51)
  Top 0.254: U9.13 60.92,27.93 v60.5,27.5
  Bottom 0.254: v60.5,27.5 55.5,32.5 55.5,43.97 S3.2
N$77  (via drill 0.51)
  Top 0.254: U9.12 60.08,28.57 v59,27.5
  Bottom 0.254: v59,27.5 54.5,32 54.5,42.43 S3.1
N$78
  Top 0.254: U4.4 121.94,66.06 122.35,65.65 C9.1
N$79  (via drill 0.51)
  Top 0.305: U5.25 21.77,33.77 v22,34
  Bottom 0.61: v22,34 22,20.18 X-A.2
N$80
  Top 0.254: U9.20 71.97,30.52 72.5,30 C29.2
N$81  (via drill 0.51)
  Top 0.254: U9.8 61.33,31.18 v61,31.5 | v62.5,48.5 POT3.2
  Bottom 0.254: v61,31.5 59.5,33 59.5,45.5 v62.5,48.5
N$82
  Top 0.406: R25.1 POT3.3
N$83
  Top 0.406: 61.5,47.5 POT3.1 R26.2
N$84
  Top 0.254: U9.22 72.67,31.82 73,31.5 C28.2
N$85
  Top 0.254: U9.24 71.62,33.12 72.5,34 74.5,34 74.85,33.65 C27.1
N$86
  Top 0.254: U9.23 72.62,32.48 C27.2
N$87
  Top 0.305: U9.11 60.73,29.23
  Top 0.61: 60.73,29.23 58.73,29.23 57.5,28 57.5,21.18 Z-B.1
N$88
  Top 0.305: U9.18 70.78,29.23
  Top 0.61: 70.78,29.23 71.5,28.5 71.5,25 70.5,24 70.5,21.5 69.5,20.5 60,20.5 51.68,12.18 Z-B.2
N$89  (via drill 0.51)
  Top 0.305: U9.4 60.73,33.77 v60.5,34
  Bottom 0.61: v60.5,34 63,31.5 63,19.68 Z-A.1
N$90  (via drill 0.51)
  Top 0.305: U9.25 70.78,33.77 v71,34
  Bottom 0.61: v71,34 71,23.82 Z-A.2
N$91
  pour Top: 63.5,27.5 61.5,27.5 60.5,26.5 60.5,24.5 61.5,23.5 65.5,23.5 65.5,25.5 63.5,25.5
N$92
  pour Top: 14.5,27.5 12.5,27.5 11.5,26.5 11.5,24.5 12.5,23.5 16.5,23.5 16.5,25.5 14.5,25.5
N$93
  pour Top: 63.5,35.5 61.5,35.5 60.5,36.5 60.5,38.5 61.5,39.5 65.5,39.5 65.5,37.5 63.5,37.5
N$94  (via drill 0.51)
  Top 0.254: U5.8 12.32,31.18 v12,31.5 | v13.5,48.5 POT1.2
  Bottom 0.254: v12,31.5 10.5,33 10.5,45.5 v13.5,48.5
N$95  (via drill 0.51)
  Top 0.254: R38.1 v94.5,18.5 | v101,18.5 R27.1 | R28.1 v107.5,18.5
  Top 0.406: S5.2 129.03,14.22 128.52,14.73 128.52,15.75 v127.51,16.76
  Bottom 0.406: v127.51,16.76 109.24,16.76 v107.5,18.5 v101,18.5 v94.5,18.5
N$96
  pour Top: 14.5,35.5 12.5,35.5 11.5,36.5 11.5,38.5 12.5,39.5 16.5,39.5 16.5,37.5 14.5,37.5
PROBE  (via drill 0.51)
  Top 0.254: R36.2 122.5,18 117.91,22.59 U6.9 111.41,22.59 v111,23 | D11.C 96,77 97,76 97,70 100,67 100,55 98,53 98,51.5 v97,50.5
  Top 0.406: R36.2 C57.1
  Bottom 0.254: v111,23 109,21 107,21 98,30 98,49.5 v97,50.5
RESET  (via drill 0.51)
  Top 0.254: C52.1 123.5,27.5 | 123.5,27.5 123.5,28.5 126,31 126,40.3 | 126,40.3 126.71,41.01 | 126.71,41.01 126.71,41 R6.1 | 126.71,41.01 S4.3 | J1.5 119.5,29 121,27.5 123.5,27.5 | v115.5,46.5 115.1,46.9 U1.29 115.1,49.4 113.5,51 105.36,51 94.49,40.13 94.49,33.53 JP17.6 | v122.5,41.5 123.7,40.3 126,40.3
  Bottom 0.254: v115.5,46.5 120.5,41.5 v122.5,41.5
RXI  (via drill 0.51)
  Top 0.254: U1.30 114.3,49.2 113,50.5 105.62,50.5 95,39.88 95,32 92.2,29.21 90.68,29.21 90.17,28.7 90.17,26.67 JP17.9 | U2.1 125.78,20.11 125.4,19.74 v125.4,13.9
  Bottom 0.254: v125.4,13.9 97.1,13.9 90.17,20.83 90.17,24.13 JP17.9
SCK-D13-SPINDLE_DIR
  Top 0.254: U1.17 119.79,38.21 120.77,37.23 120.77,34.73 J1.3
STEP_ENABLE  (via drill 0.51, 0.51 pad 0.25)
  Top 0.254: U5.26 20.93,34.42 21.5,35 24,35 25,36 26,36 26.5,35.5 26.5,35 27.5,34 27.5,24 v31.5,20 | U8.26 45.42,34.42 46,35 v48,35 | U9.26 69.92,34.42 70.5,35 73,35 74,36 76.01,36 76.5,35.51 v76.5,26.67 v76.5,19 v60.5,19 | v34.5,20 v44.5,20 | U7.4 104.65,31 | 104.65,31 104.65,29.65 103.5,28.5 103.5,27.5 97.34,21.34 84.33,21.34 v83.82,21.84 | R49.2 99,69 100.5,67.5 100.5,54 v99,52.5 | v103.5,31 104.65,31 | JP19.6 79.5,33.78 v79.5,26.67
  Bottom 0.254: v31.5,20 v34.5,20 | v44.5,20 48,20 | v48,35 48,20 | 48,20 59.5,20 v60.5,19 | v99,52.5 99,35.5 v103.5,31 | v79.5,26.67 v76.5,26.67 | v76.5,19 78.1,20.6 82.58,20.6 v83.82,21.84
TXO  (via drill 0.51)
  Top 0.254: U1.31 113.5,49 112.5,50 105.88,50 95.5,39.62 95.5,31.75 93.73,29.97 93.73,27.69 JP17.10 | U2.5 128.38,20.77 128.1,20.5 127,20.5 125.9,19.4 125.9,15.4 v126.3,15
  Bottom 0.254: v126.3,15 125.2,15 124.6,14.4 97.3,14.4 91.95,19.75 91.95,20.83 92.96,21.84 92.96,23.88 JP17.10
VCC
  Top 0.813: C42.1 85.6,67.4 88,65 92.18,65 JP15.2
  Top 1.016: C42.1 85.32,69.28 U10.2 81.78,69.28 81,68.5 81,64 83,62 83,54.67 86.87,50.8 86.87,47.75 JP16.5
  Bottom 1.778: JP16.5 JP16.7
VCC_USB  (via drill 0.51 pad 0.25)
  Top 0.254: U2.4 127.72,24.23 v130,26.5 130.97,27.48 U2.20
  Bottom 0.254: v135.5,26.5 v130,26.5
  pour Top: 139,20 140.5,20 140.5,28.5 134.5,28.5 134.5,25 134.5,24.5
VIN  (via drill 0.51, 0.51 pad 0.25)
  Top 0.254: C6.1 51,31.5 51.5,32 51.5,33.5 v50,35 | C17.1 26.5,31.5 27,32 27,33.5 v25.5,35 | C28.1 75.5,31.5 76,32 76,33.5 v74.5,35
  Top 0.406: R50.1 140.82,64.92 140.9,65 | v141,54.5 141.15,54.35 R51.1 | VIN.2 146.47,63.65 C2.2 140.89,63.7 140.9,63.71 140.9,65 | R56.1 141.55,66.75 140.9,66.1 140.9,65
  Top 1.016: U10.1 83.78,64.72 84.5,64 v84.5,62 v84.5,60.5 84.5,55.2 JP16.1 JP16.3 | JP19.4 JP19.5
  Bottom 0.254: v45,37 48,37 v50,35 | v25.5,35 23.5,37 v20.5,37 | v74.5,35 72.5,37 v69.5,37
  Bottom 1.016: JP19.5 86.87,38.61 86.87,46.23 JP16.3
  other vias: 20.5,38 19.5,38 19.5,37 20.5,25 19.5,25 19.5,26 20.5,26 45,25 44,25 44,26 45,26 45,38 44,38 44,37 69.5,38 68.5,38 68.5,37 69.5,25 68.5,25 68.5,26 69.5,26 118.2,61.2 119.5,61.2 120.8,61.2 118.2,59.9 119.5,59.9 118.2,57.4 119.5,57.4 118.2,58.6 119.5,58.6
  pour Bottom: 150,42 136.5,42 136.5,67.5 150,67.5
  pour Top: 19,35.5 20.5,35.5 21,36 21,41.5 17,41.5 17,37.5
  pour Top: 19.5,27.5 20,27.5 21,26.5 21,21.5 17,21.5 17,25
  pour Bottom: 21,38.5 21,36.5 20,35.5 20,27.5 21,26.5 21,24 19,24 19,38.5
  pour Top: 44,27.5 44.5,27.5 45.5,26.5 45.5,21.5 41.5,21.5 41.5,25
  pour Top: 43.5,35.5 45,35.5 45.5,36 45.5,41.5 41.5,41.5 41.5,37.5
  pour Bottom: 21,38.5 21,36.5 20,35.5 20,27.5 21,26.5 21,24.5 19,24.5 19,38.5
  pour Bottom: 45.5,38.5 45.5,36.5 44.5,35.5 44.5,27.5 45.5,26.5 45.5,24.5 43.5,24.5 43.5,38.5
  pour Top: 68.5,27.5 69,27.5 70,26.5 70,21.5 66,21.5 66,25
  pour Top: 68,35.5 69.5,35.5 70,36 70,41.5 66,41.5 66,37.5
  pour Bottom: 70,38.5 70,36.5 69,35.5 69,27.5 70,26.5 70,24.5 68,24.5 68,38.5
  pour Bottom: 17,37.5 18,36.5 21,36.5 21,57 41.5,57 41.5,37.5 42.5,36.5 46,36.5 46,57 61.5,57 61.5,53 66,48.5 66,37.5 67,36.5 70,36.5 70,47.74 64.74,53 64.74,56.49 68,59.5 87,59.5 89,57.5 138,57 137.5,62.5 90.76,62.49 87.5,65.5 68.02,65.5 63.5,61.23 17,61.23
  pour Top: 120.7,67.8 120.7,66.2 119.6,66.2 119.6,64.4 121.8,64.4 121.8,60.9 122.5,60.9 122.5,56.9 117.7,56.9 117.7,66.8 118.7,67.8
X_LIM  (via drill 0.51 pad 0.25)
  Top 0.254: D6.C 29.5,76.5 30.5,75.5 58,75.5 58.5,75 58.5,73 77.5,54 77.5,21.69 79.7,19.49 98.5,19.49 | C54.1 98.5,19.49 | v101,23 101,24 104.5,27.5 104.5,28.5 104.94,28.95 U6.1 | 98.5,19.49 100.49,19.49 v101,20
  Top 0.406: R30.2 C54.1
  Bottom 0.254: v101,20 v101,23
Y_LIM  (via drill 0.51 pad 0.25)
  Top 0.254: D10.C 43,76.5 43.5,76 58.5,76 59,75.5 59,73.5 78,54.5 78,22.08 80.01,20.07 99.57,20.07 100.5,21 v102.5,21 103,20.5 R33.2 | v102.5,23 102.5,24.5 104.41,26.41 U6.3
  Top 0.406: R33.2 C55.1
  Bottom 0.254: v102.5,21 v102.5,23
Z_LIM
  Top 0.254: R34.2 109.5,22.5 108.14,23.86 U6.5 104.86,23.86 102.86,21.86 100.61,21.86 99.31,20.57 80.26,20.57 78.5,22.34 78.5,55 59.5,74 59.5,76 58,77.5 D14.C
  Top 0.406: R34.2 C56.1

## Text on the board
Top: v02
tPlace: E-Stop | Probe | Step En | X Direction | X Step | X Limit | Y Direction | Y Step | Y Limit | Z Direction | Z Step | Z Limit | POWER | + | Step Size | Step Size | Step Size | - | + | Stepoko | FULL | FULL | FULL | - | 1/2 | Powered by GRBL | 1/2 | 1/2 | +12V FAN | 1/4 | 1/4 | 1/4 | Current / Limit | Current / Limit | Current / Limit | 1/8 | 1/8 | 1/8 | Reverse / Protection | 0.5A | 0.5A | X DIRECTION | VIN | +5V | RESET | 2.0A | 2.0A | Y DIRECTION | VIN | E-STOP | 0.5A | 2.0A | Z DIRECTION | +12V | RESET/ABORT | 16MHz | Z STEP | +12V | FEED_HOLD | Y STEP | GND | CYCLE START / /RESUME | X STEP | GND | COOLANT / ENABLE | STEP / ENABLE | GND | A4 | TX | RX | VIN | GND | PROBE | VIN / +12-30V | VIN | GND | RESET | +5V | AREF | GND | GND | RXI | TXO | GND | A7 | A6 | Pull Up | X-Axis | Y-Axis | Z-Axis | Limit Switch | Pull Down | B+ | B- | A+ | A- | B+ | B- | A+ | A- | B+ | B- | A+ | A- | X Limit | Y Limit | Z Limit | E-Stop | Probe
bPlace: + | - | + | - | +12V FAN | X DIRECTION | VIN | +5V | Y DIRECTION | VIN | E-STOP | Z DIRECTION | +12V | RESET/ABORT | Z STEP | +12V | FEED_HOLD | Y STEP | GND | CYCLE START / /RESUME | X STEP | GND | COOLANT / ENABLE | STEP / ENABLE | GND | A4 | VIN | GND | PROBE | VIN / +12-30V | VIN | GND | RESET | +5V | AREF | GND | GND | RXI | TXO | GND | A7 | A6 | X-Axis | Y-Axis | Z-Axis | B+ | B- | A+ | A- | B+ | B- | A+ | A- | B+ | B- | A+ | A- | X Limit | Y Limit | Z Limit | E-Stop | Probe
tDocu: Casey Kuhns